# Altium schematic sheet Mcontr_2.SchDoc
size 420 x 297 mm; Address1: Address1; Address2: Address2; Address3: Address3; Address4: Address4; DocumentNumber: ИМ 1301.10A.01.400 Э3; SheetNumber: 2; Scale: 1:1; DocumentType: Схема электрическая принципиальная
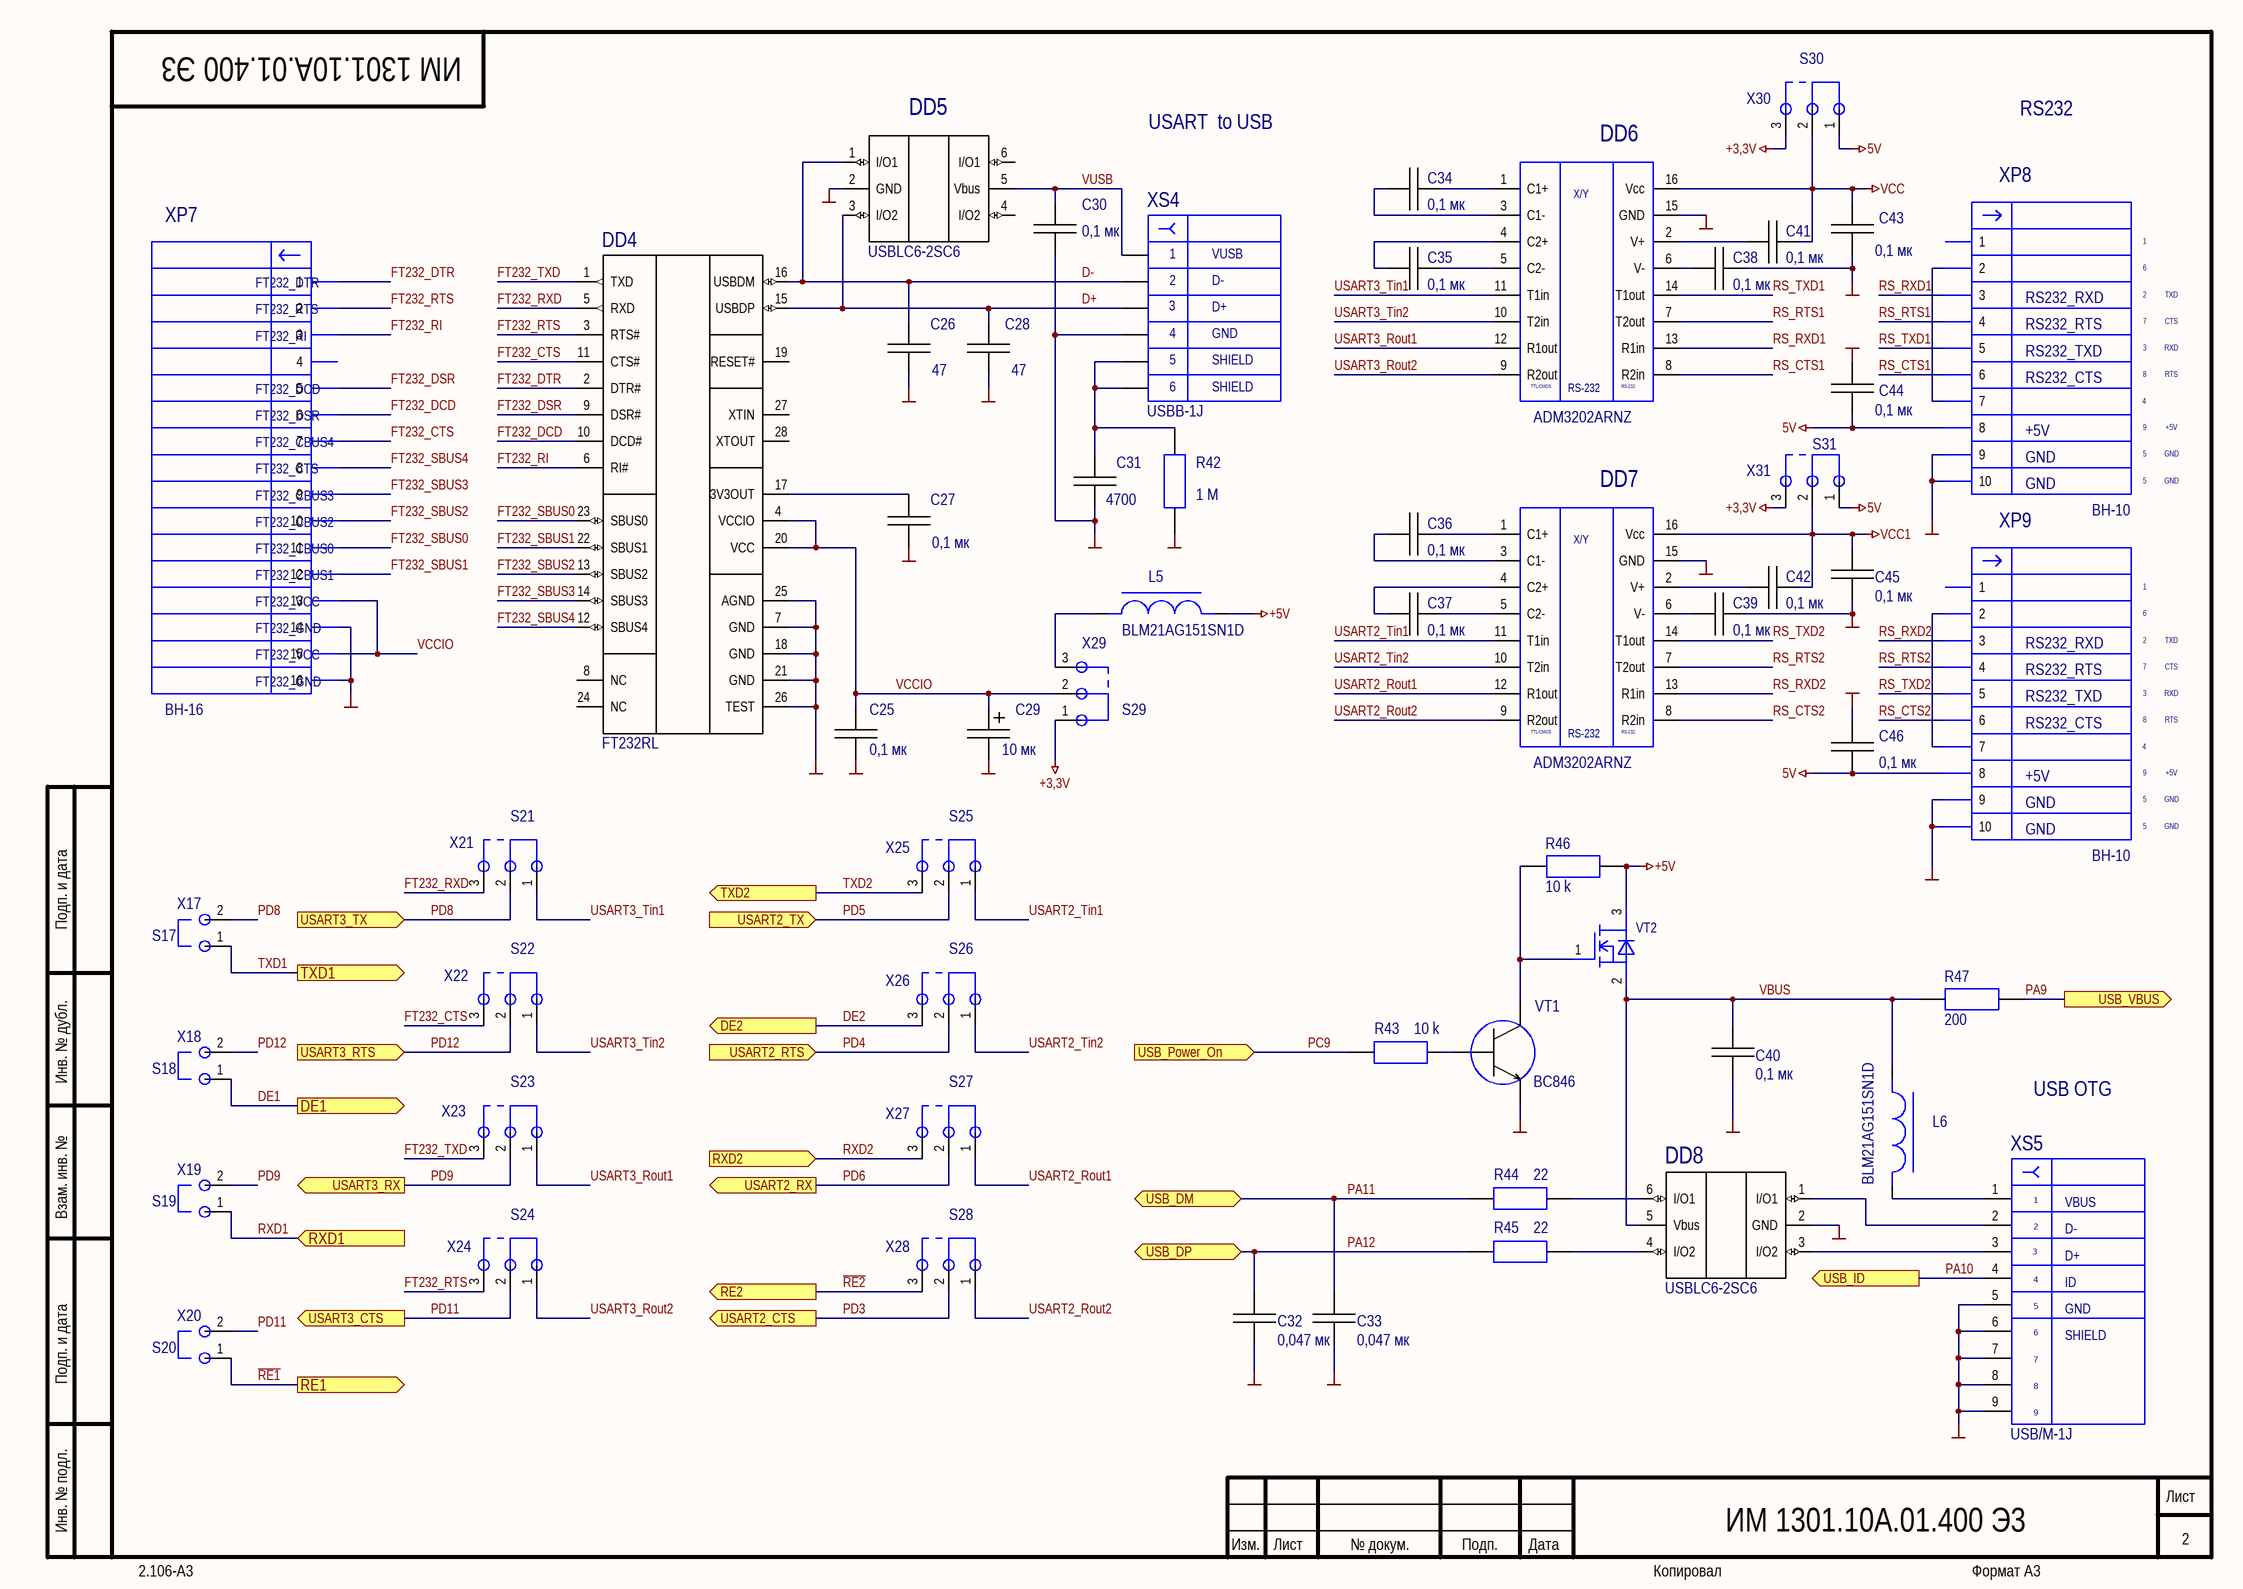
[diagram p0: Mcontr_2.SchDoc]

## Parts
C25  0,1 мк  [CAPC_1206]
C26  47  [CAPC_1206]
C27  0,1 мк  [CAPC_1206]
C28  47  [CAPC_1206]
C29  10 мк  [3216]
C30  0,1 мк  [CAPC_1206]
C31  4700  [CAPC_1206]
C32  0,047 мк  [CAPC_1206]
C33  0,047 мк  [CAPC_1206]
C34  0,1 мк  [CAPC_1206]
C35  0,1 мк  [CAPC_1206]
C36  0,1 мк  [CAPC_1206]
C37  0,1 мк  [CAPC_1206]
C38  0,1 мк  [CAPC_1206]
C39  0,1 мк  [CAPC_1206]
C40  0,1 мк  [CAPC_1206]
C41  0,1 мк  [CAPC_1206]
C42  0,1 мк  [CAPC_1206]
C43  0,1 мк  [CAPC_1206]
C44  0,1 мк  [CAPC_1206]
C45  0,1 мк  [CAPC_1206]
C46  0,1 мк  [CAPC_1206]
DD4  FT232RL  [SSOP28]
DD5  USBLC6-2SC6  [SOT23-6L]
DD6  ADM3202ARNZ  [SO16]
DD7  ADM3202ARNZ  [SO16]
DD8  USBLC6-2SC6  [SOT23-6L]
L5  BLM21AG151SN1D  [C0805]
L6  BLM21AG151SN1D  [C0805]
R42  1 M  [SMD_1206]
R43  10 k  [SMD_1206]
R44  22  [SMD_1206]
R45  22  [SMD_1206]
R46  10 k  [SMD_1206]
R47  200  [SMD_1206]
VT1  BC846  [SOT23]
VT2  IRLML2502  [SOT23]  (value not drawn)
X17  Jamper: S17  [PLS-2]  (hidden comment: PLS-02)
X18  Jamper: S18  [PLS-2]  (hidden comment: PLS-02)
X19  Jamper: S19  [PLS-2]  (hidden comment: PLS-02)
X20  Jamper: S20  [PLS-2]  (hidden comment: PLS-02)
X21  Jamper: S21  [PLS-3]  (hidden comment: PLS-03)
X22  Jamper: S22  [PLS-3]  (hidden comment: PLS-03)
X23  Jamper: S23  [PLS-3]  (hidden comment: PLS-03)
X24  Jamper: S24  [PLS-3]  (hidden comment: PLS-03)
X25  Jamper: S25  [PLS-3]  (hidden comment: PLS-03)
X26  Jamper: S26  [PLS-3]  (hidden comment: PLS-03)
X27  Jamper: S27  [PLS-3]  (hidden comment: PLS-03)
X28  Jamper: S28  [PLS-3]  (hidden comment: PLS-03)
X29  Jamper: S29  [PLS-3]  (hidden comment: PLS-03)
X30  Jamper: S30  [PLS-3]  (hidden comment: PLS-03)
X31  Jamper: S31  [PLS-3]  (hidden comment: PLS-03)
XP7  BH-16  [PLD-16]
XP8  BH-10  [PLD-10]
XP9  BH-10  [PLD-10]
XS4  USBB-1J  [USBB-1J]
XS5  USB/M-1J  [MINIUSB]

## Ports
DE1 (out), DE2 (out), RE1 (out), RE2 (out), RXD1 (in), RXD2 (in), TXD1 (out), TXD2 (out), USART2_CTS (out), USART2_RTS (in), USART2_RX (out), USART2_TX (in), USART3_CTS (out), USART3_RTS (in), USART3_RX (out), USART3_TX (in), USB_DM (bidir), USB_DP (bidir), USB_ID (out), USB_Power_On (in), USB_VBUS (out)

## Nets
5V: C44.1 C46.1 X30.1 X31.1 XP8.8 XP9.8
+3,3V: X29.1 X30.3 X31.3
+5V: L5.2 R46.2 VT2.3(D)
GND: C25.1 C26.1 C27.1 C28.1 C29.2(-) C30.1 C31.1 C32.1 C33.1 C38.2 C39.2 C40.1 C43.1 C44.2 C45.1 C46.2 DD4.7(GND) DD4.18(GND) DD4.21(GND) DD4.25(AGND) DD4.26(TEST) DD5.2(GND) DD6.15(GND) DD7.15(GND) DD8.2(GND) R42.1 VT1.2(E) XP7.14 XP7.16 XP8.9 XP8.10 XP9.9 XP9.10 XS4.4 XS5.5 XS5.6 XS5.7 XS5.8 XS5.9
VCC: C41.2 C43.2 DD6.16(Vcc) X30.2
VCC1: C42.2 C45.2 DD7.16(Vcc) X31.2
~{RE1}: X20.1 ; port RE1
~{RE2}: X28.3 ; port RE2
D+: C28.2 DD4.15(USBDP) DD5.3(I/O2) XS4.3
D-: C26.2 DD4.16(USBDM) DD5.1(I/O1) XS4.2
DE1: X18.1 ; port DE1
DE2: X26.3 ; port DE2
FT232_CTS: DD4.11(CTS#) X22.3 XP7.7
FT232_DCD: DD4.10(DCD#) XP7.6
FT232_DSR: DD4.9(DSR#) XP7.5
FT232_DTR: DD4.2(DTR#) XP7.1
FT232_RI: DD4.6(RI#) XP7.3
FT232_RTS: DD4.3(RTS#) X24.3 XP7.2
FT232_RXD: DD4.5(RXD) X21.3
FT232_SBUS0: DD4.23(SBUS0) XP7.11
FT232_SBUS1: DD4.22(SBUS1) XP7.12
FT232_SBUS2: DD4.13(SBUS2) XP7.10
FT232_SBUS3: DD4.14(SBUS3) XP7.9
FT232_SBUS4: DD4.12(SBUS4) XP7.8
FT232_TXD: DD4.1(TXD) X23.3
PA9: R47.2 ; port USB_VBUS
PA10: XS5.4 ; port USB_ID
PA11: C33.2 R44.2 ; port USB_DM
PA12: C32.2 R45.2 ; port USB_DP
PC9: R43.2 ; port USB_Power_On
PD3: X28.2 ; port USART2_CTS
PD4: X26.2 ; port USART2_RTS
PD5: X25.2 ; port USART2_TX
PD6: X27.2 ; port USART2_RX
PD8: X17.2 X21.2 ; port USART3_TX
PD9: X19.2 X23.2 ; port USART3_RX
PD11: X20.2 X24.2 ; port USART3_CTS
PD12: X18.2 X22.2 ; port USART3_RTS
RS_CTS1: DD6.8(R2in) XP8.6
RS_CTS2: DD7.8(R2in) XP9.6
RS_RTS1: DD6.7(T2out) XP8.4
RS_RTS2: DD7.7(T2out) XP9.4
RS_RXD1: DD6.13(R1in) XP8.3
RS_RXD2: DD7.13(R1in) XP9.3
RS_TXD1: DD6.14(T1out) XP8.5
RS_TXD2: DD7.14(T1out) XP9.5
RXD1: X19.1 ; port RXD1
RXD2: X27.3 ; port RXD2
TXD1: X17.1 ; port TXD1
TXD2: X25.3 ; port TXD2
USART2_Rout1: DD7.12(R1out) X27.1
USART2_Rout2: DD7.9(R2out) X28.1
USART2_Tin1: DD7.11(T1in) X25.1
USART2_Tin2: DD7.10(T2in) X26.1
USART3_Rout1: DD6.12(R1out) X23.1
USART3_Rout2: DD6.9(R2out) X24.1
USART3_Tin1: DD6.11(T1in) X21.1
USART3_Tin2: DD6.10(T2in) X22.1
VBUS: C40.2 DD8.5(Vbus) L6.1 R47.1 VT2.2(S)
VCCIO: C25.2 C29.1(+) DD4.4(VCCIO) DD4.20(VCC) X29.2 XP7.13 XP7.15
VUSB: C30.2 DD5.5(Vbus) XS4.1
NetC27_2: C27.2 DD4.17(3V3OUT)
NetC31_2: C31.2 R42.2 XS4.5 XS4.6
NetC34_1: C34.1 DD6.3(C1-)
NetC34_2: C34.2 DD6.1(C1+)
NetC35_1: C35.1 DD6.4(C2+)
NetC35_2: C35.2 DD6.5(C2-)
NetC36_1: C36.1 DD7.3(C1-)
NetC36_2: C36.2 DD7.1(C1+)
NetC37_1: C37.1 DD7.4(C2+)
NetC37_2: C37.2 DD7.5(C2-)
NetC38_1: C38.1 DD6.6(V-)
NetC39_1: C39.1 DD7.6(V-)
NetC41_1: C41.1 DD6.2(V+)
NetC42_1: C42.1 DD7.2(V+)
NetDD8_1: DD8.1(I/O1) XS5.2
NetDD8_3: DD8.3(I/O2) XS5.3
NetDD8_4: DD8.4(I/O2) R45.1
NetDD8_6: DD8.6(I/O1) R44.1
NetL5_1: L5.1 X29.3
NetL6_2: L6.2 XS5.1
NetR43_1: R43.1 VT1.1(B)
NetR46_1: R46.1 VT1.3(K) VT2.1(G)
NetXP8_2: XP8.2 XP8.7
NetXP9_2: XP9.2 XP9.7

Not connected (* = marked no-connect by the designer): DD4 8(NC) 19(RESET#) 24(NC) 27(XTIN) 28(XTOUT); DD5 4(I/O2) 6(I/O1); XP7 4; XP8 1; XP9 1

## Notes on the sheet
- RS232
- USART  to USB
- VUSB
- 1
- FT232_DTR
- FT232_RTS
- D-
- D+
- (near XP8) RS232_RTS
- (near XP8) RS232_RXD
- 2
- 6
- 7
- TXD
- CTS
- FT232_RI
- FT232_DCD
- GND
- SHIELD
- (near XP8) RS232_CTS
- (near XP8) RS232_TXD
- 4
- 8
- 3
- RTS
- RXD
- FT232_DSR
- FT232_CBUS4
- (near XP8) GND
- (near XP8) +5V
- 9
- 5
- +5V
- FT232_CTS
- FT232_CBUS3
- FT232_CBUS2
- FT232_CBUS0
- FT232_CBUS1
- FT232_VCC
- FT232_GND
- (near XP9) RS232_RXD
- (near XP9) RS232_CTS
- (near XP9) RS232_TXD
- (near XP9) RS232_RTS
- (near XP9) +5V
- (near XP9) GND
- USB OTG
- (near XS5) VBUS
- (near XS5) D-
- (near XS5) D+
- (near XS5) ID
- (near XS5) GND
- (near XS5) SHIELD
- Подп. и дата
- Инв. № дубл.
- Взам. инв. №
- Инв. № подл.
- Изм.
- Лист
- № докум.
- Подп.
- Дата
- 2.106-A3
- Копировал
- Формат А3
- (in symbol ADM202) X/Y; TTL/CMOS; RS-232

## Library data of the parts
C25-C28 C30-C46 = C: Capasitor; MarkPCB: *; Name: *; Part Number: C; Component Kind: Standard; Component Type: Standard; Designator: C; Footprint: K73-17; Pin Count: 2
  C25 C27 C30 C34-C46: ValueSCH: 0,1 мк
  C26 C28: ValueSCH: 47
  C31: ValueSCH: 4700
  C32 C33: ValueSCH: 0,047 мк
C29 = CapPol: Capasitor_polar; ValueSCH: 10 мк; Part Number: CapPol; Component Kind: Standard; Component Type: Standard; Designator: CapPol; Footprint: CapPolar; Pin Count: 2
DD4 = FT232RL: USB to UART interface; Firma: FTDI chip; Mark: FT232RL
DD5 DD8 = USBLC6: ESD PROTECTION; Mark: USBLC6-2SC6
DD6 DD7 = ADM202: CMOS RS232 drivers/receivers; Value: ADM202; Value1: ADM3202ARNZ
L5 L6 = B: Ferrite bead; Value: BLM21AG151SN1D; datasheet: *
R42-R47 = R_Gost: Resistor,2 Pin; ValueBOM: *; MarkPCB: *
  R42: ValueSCH: 1 M
  R43 R46: ValueSCH: 10 k
  R44 R45: ValueSCH: 22
  R47: ValueSCH: 200
VT1 = BC846: Transistor NPN Generic; Mark: BC846
X17-X20 = J2: Value: PLS-02
X21-X31 = J3: Value: PLS-03
XS4 = USBB-1J: Firma1: YAMAICHI; Value: USBB-1J
XS5 = USB/M-1J: 9 pin connector, USB mini; Firma: BM; Value: USB/M-1J
VT2 = IRLML2502: Value: IRLML2502
XP7 = BH-16: Value: BH-16
XP8 XP9 = BH-10: Value: BH-10